# Altium schematic sheet programmer.SchDoc
size A4
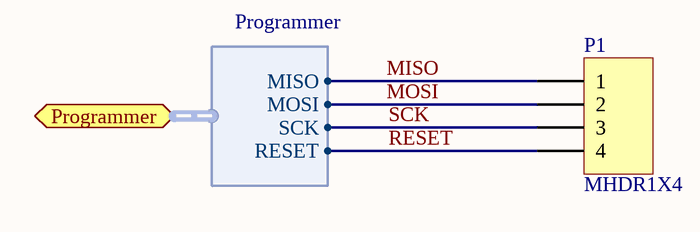
[diagram p0: programmer.SchDoc]

## Parts
P1  MHDR1X4  [MHDR1X4]

## Ports
Programmer (harness Programmer)

## Harnesses
Programmer: MISO, MOSI, SCK, RESET

## Nets
MISO: P1.1 ; port Programmer.MISO
MOSI: P1.2 ; port Programmer.MOSI
RESET: P1.4 ; port Programmer.RESET
SCK: P1.3 ; port Programmer.SCK

## Library data of the parts
P1 = MHDR1X4: Header, 4-Pin; LatestRevisionDate: 17-Jul-2002; LatestRevisionNote: Re-released for DXP Platform.; Publisher: Altium Limited